# EAGLE design res15_board (EAGLE 7.2.0)
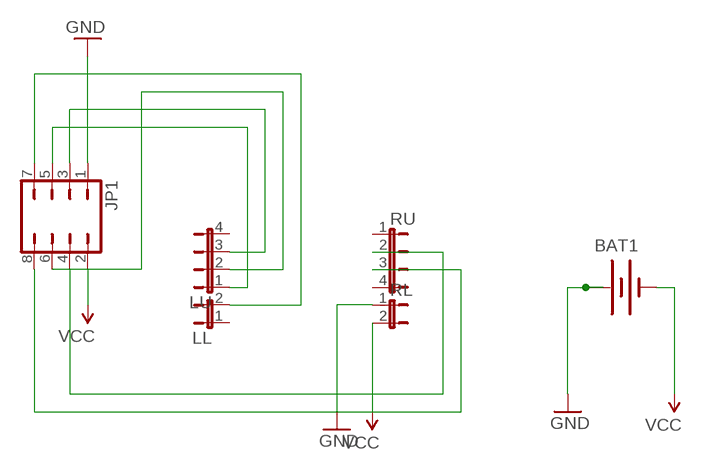
[diagram p0: schematic, sheet 1]

## Parts
BAT1  BATTERY245MM  [BATTCON_245MM]
JP1  JP4Q  [JP4Q]
LL  JP1E  [JP1]
LU  JP4E  [JP4]
RL  JP1E  [JP1]
RU  JP4E  [JP4]

## Nets
GND: BAT1.1(+) JP1.1 RL.1
N$3: JP1.5 LU.1
N$4: JP1.3 LU.3
N$5: JP1.4 RU.2
N$6: JP1.6 LU.2
N$7: JP1.7 LL.2
N$8: JP1.8 RU.3
VCC: BAT1.2(-) JP1.2 RL.2
Unconnected: LL.1 LU.4 RU.1 RU.4

## Library data of the parts
BAT1 = SparkFun:BATTERY: Battery Holders Various common sizes : AA, AAA, 20mm coin cell and 12mm coin cell.
JP1 = jumper:JP4Q: JUMPER
LL RL = jumper:JP1E: JUMPER
LU RU = jumper:JP4E: JUMPER

## Board
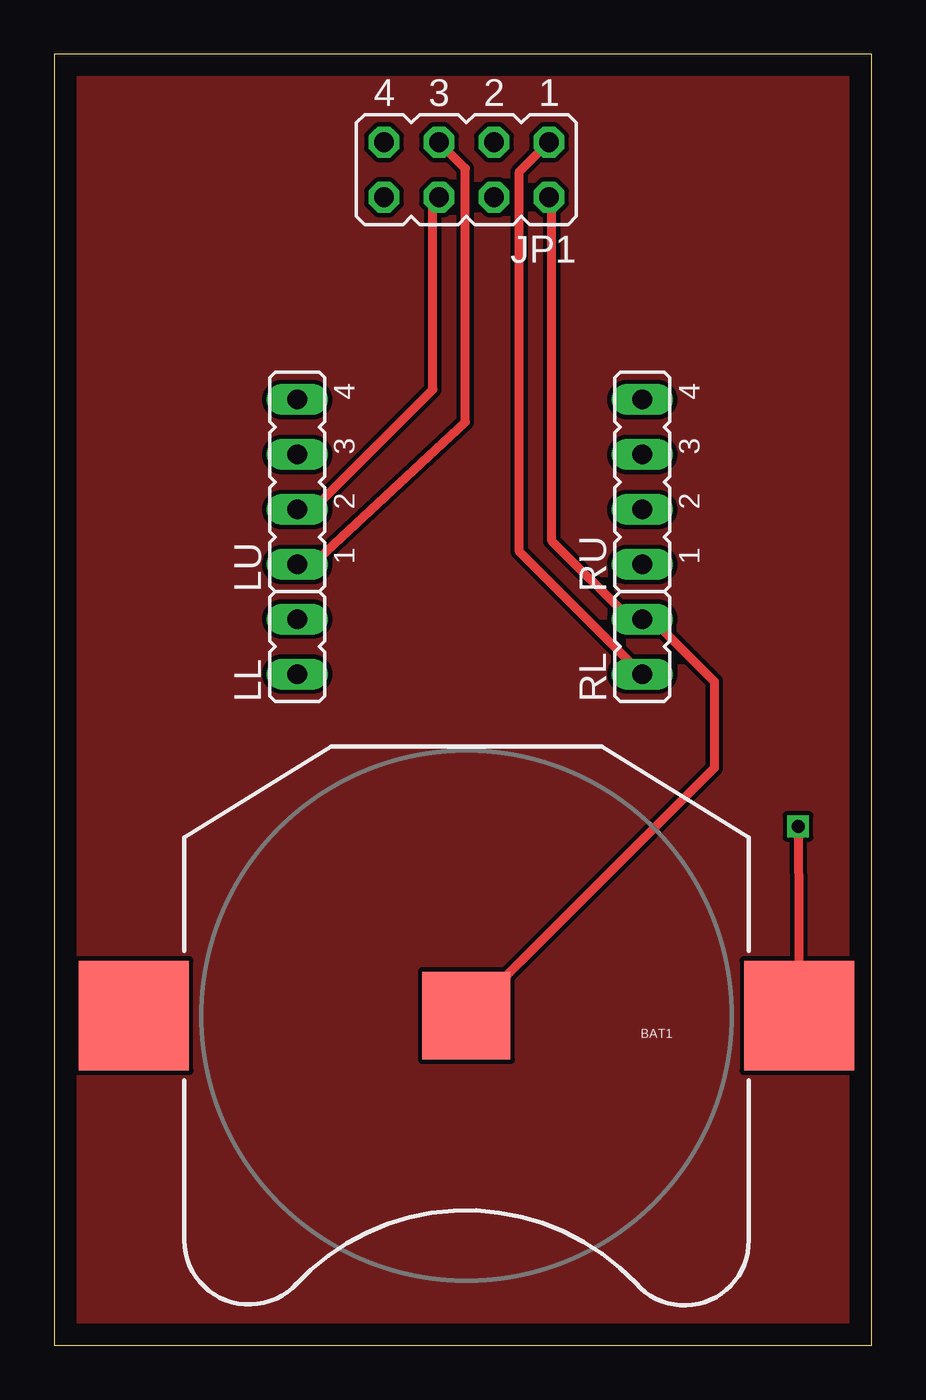
[diagram p1: board, top side]
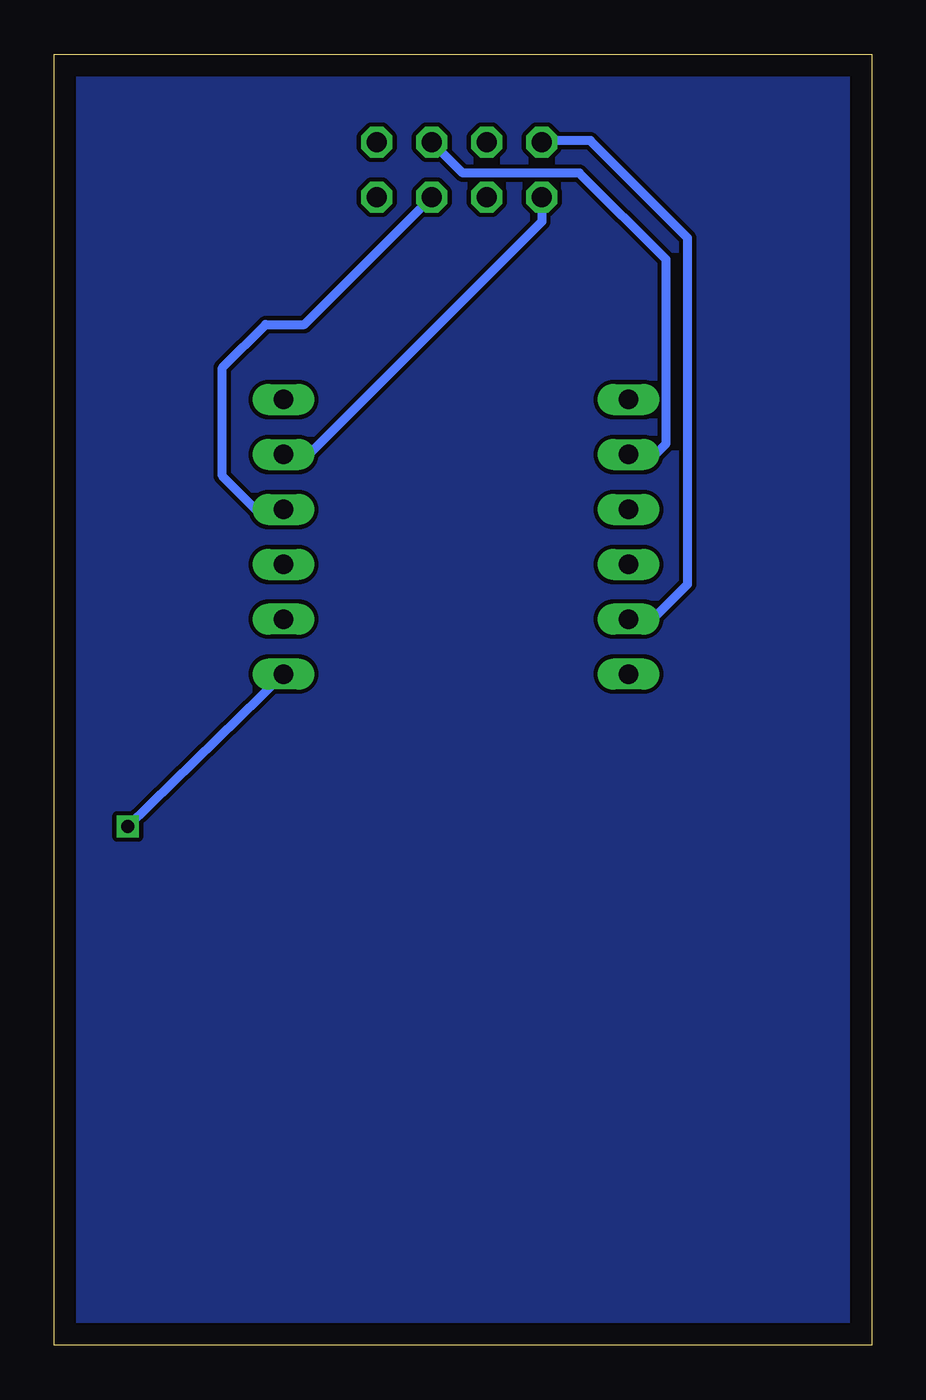
[diagram p2: board, bottom side, seen from below]

Size 37.77 x 59.68 mm. Coordinates in mm from the lower left corner, seen from the top.
Outline: 0,0 37.77,0 37.77,59.68 0,59.68 0,0
Copper layers (1*16): Top 0.035mm / dielectric 1.5mm / Bottom 0.035mm
Design rules "default": minimum track width 10mil, minimum drill 24mil, track to track 8mil, track to pad 8mil, pad to pad 8mil, via to via 8mil, smd to smd 8mil, copper to edge 40mil, drill to drill 8mil, minimum pad ring 10mil, minimum via ring 8mil, stop-mask expansion 4mil, vias tented up to drill 0mil, thermal gap 10mil

### Footprints (pad centres in the part's own frame; a part is rotated, then mirrored left to right if it is on the bottom)
BATTCON_245MM = smd 5.08 x 5.08: 1 -15.367,0; 3 15.367,0 | smd 4.064 x 4.064: 2 0,0
JP4Q = drill 0.914 octagon: 1 -3.81,-1.27; 2 -3.81,1.27; 3 -1.27,-1.27; 4 -1.27,1.27; 5 1.27,-1.27; 6 1.27,1.27; 7 3.81,-1.27; 8 3.81,1.27
JP1 = drill 0.914 long: 1 0,-1.27; 2 0,1.27
JP4 = drill 0.914 long: 1 -3.81,0; 2 -1.27,0; 3 1.27,0; 4 3.81,0

### Placement (x,y rotation side)
BAT1  19.05,15.24 180 top
JP1  19.05,54.34 180 top
LL  11.23,32.29 0 top
LU  11.23,39.91 90 top
RL  27.17,32.29 0 top
RU  27.17,39.91 90 top

### Tracks (layer width: path | path; a pad name or v marks a point on that pad's centre or on a via)
GND  (via drill 0.6)
  Top 0.406: RL.1 21.5,36.68 21.5,54.25 JP1.1 | v34.37,23.99 BAT1.1
  Bottom 0.406: RL.1 v34.37,23.99
N$1
  pour Bottom: 0,59.69 38.1,59.69 38.1,0 0,0
  pour Top: 0,59.69 38.1,59.69 38.1,0 0,0
N$3
  Top 0.406: LU.1 11.92,36.1 19,42.68 19,54.39 JP1.5
N$4
  Bottom 0.406: LU.3 10,41.18 9.5,41.68 9.5,50.18 13.5,54.18 18.89,54.18 JP1.3
N$5
  Bottom 0.406: RU.2 28.46,38.64 30,40.18 30,45.18 28,47.18 26.21,47.18 JP1.4
N$6
  Top 0.406: LU.2 11.96,38.64 17.5,44.18 17.5,52.79 JP1.6
N$7
  Bottom 0.406: LL.2 10.12,33.56 8.5,35.18 8.5,51.18 13,55.68 15.17,55.68 JP1.7
N$8
  Bottom 0.406: JP1.8 15.24,51.94 26,41.18 RU.3
VCC
  Top 0.406: JP1.2 23,52.93 23,37.18 26.62,33.56 RL.2 27.62,33.56 30.5,30.68 30.5,26.69 BAT1.2